# Altium schematic sheet 3_Load_Cell_Biasing.SchDoc
size A3; Organization: Altium Limited; Address1: L3, 12a Rodborough Rd; Address2: Frenchs Forest; Address3: NSW; Address4: Australia 2086; SheetNumber: 3; SheetTotal: 8
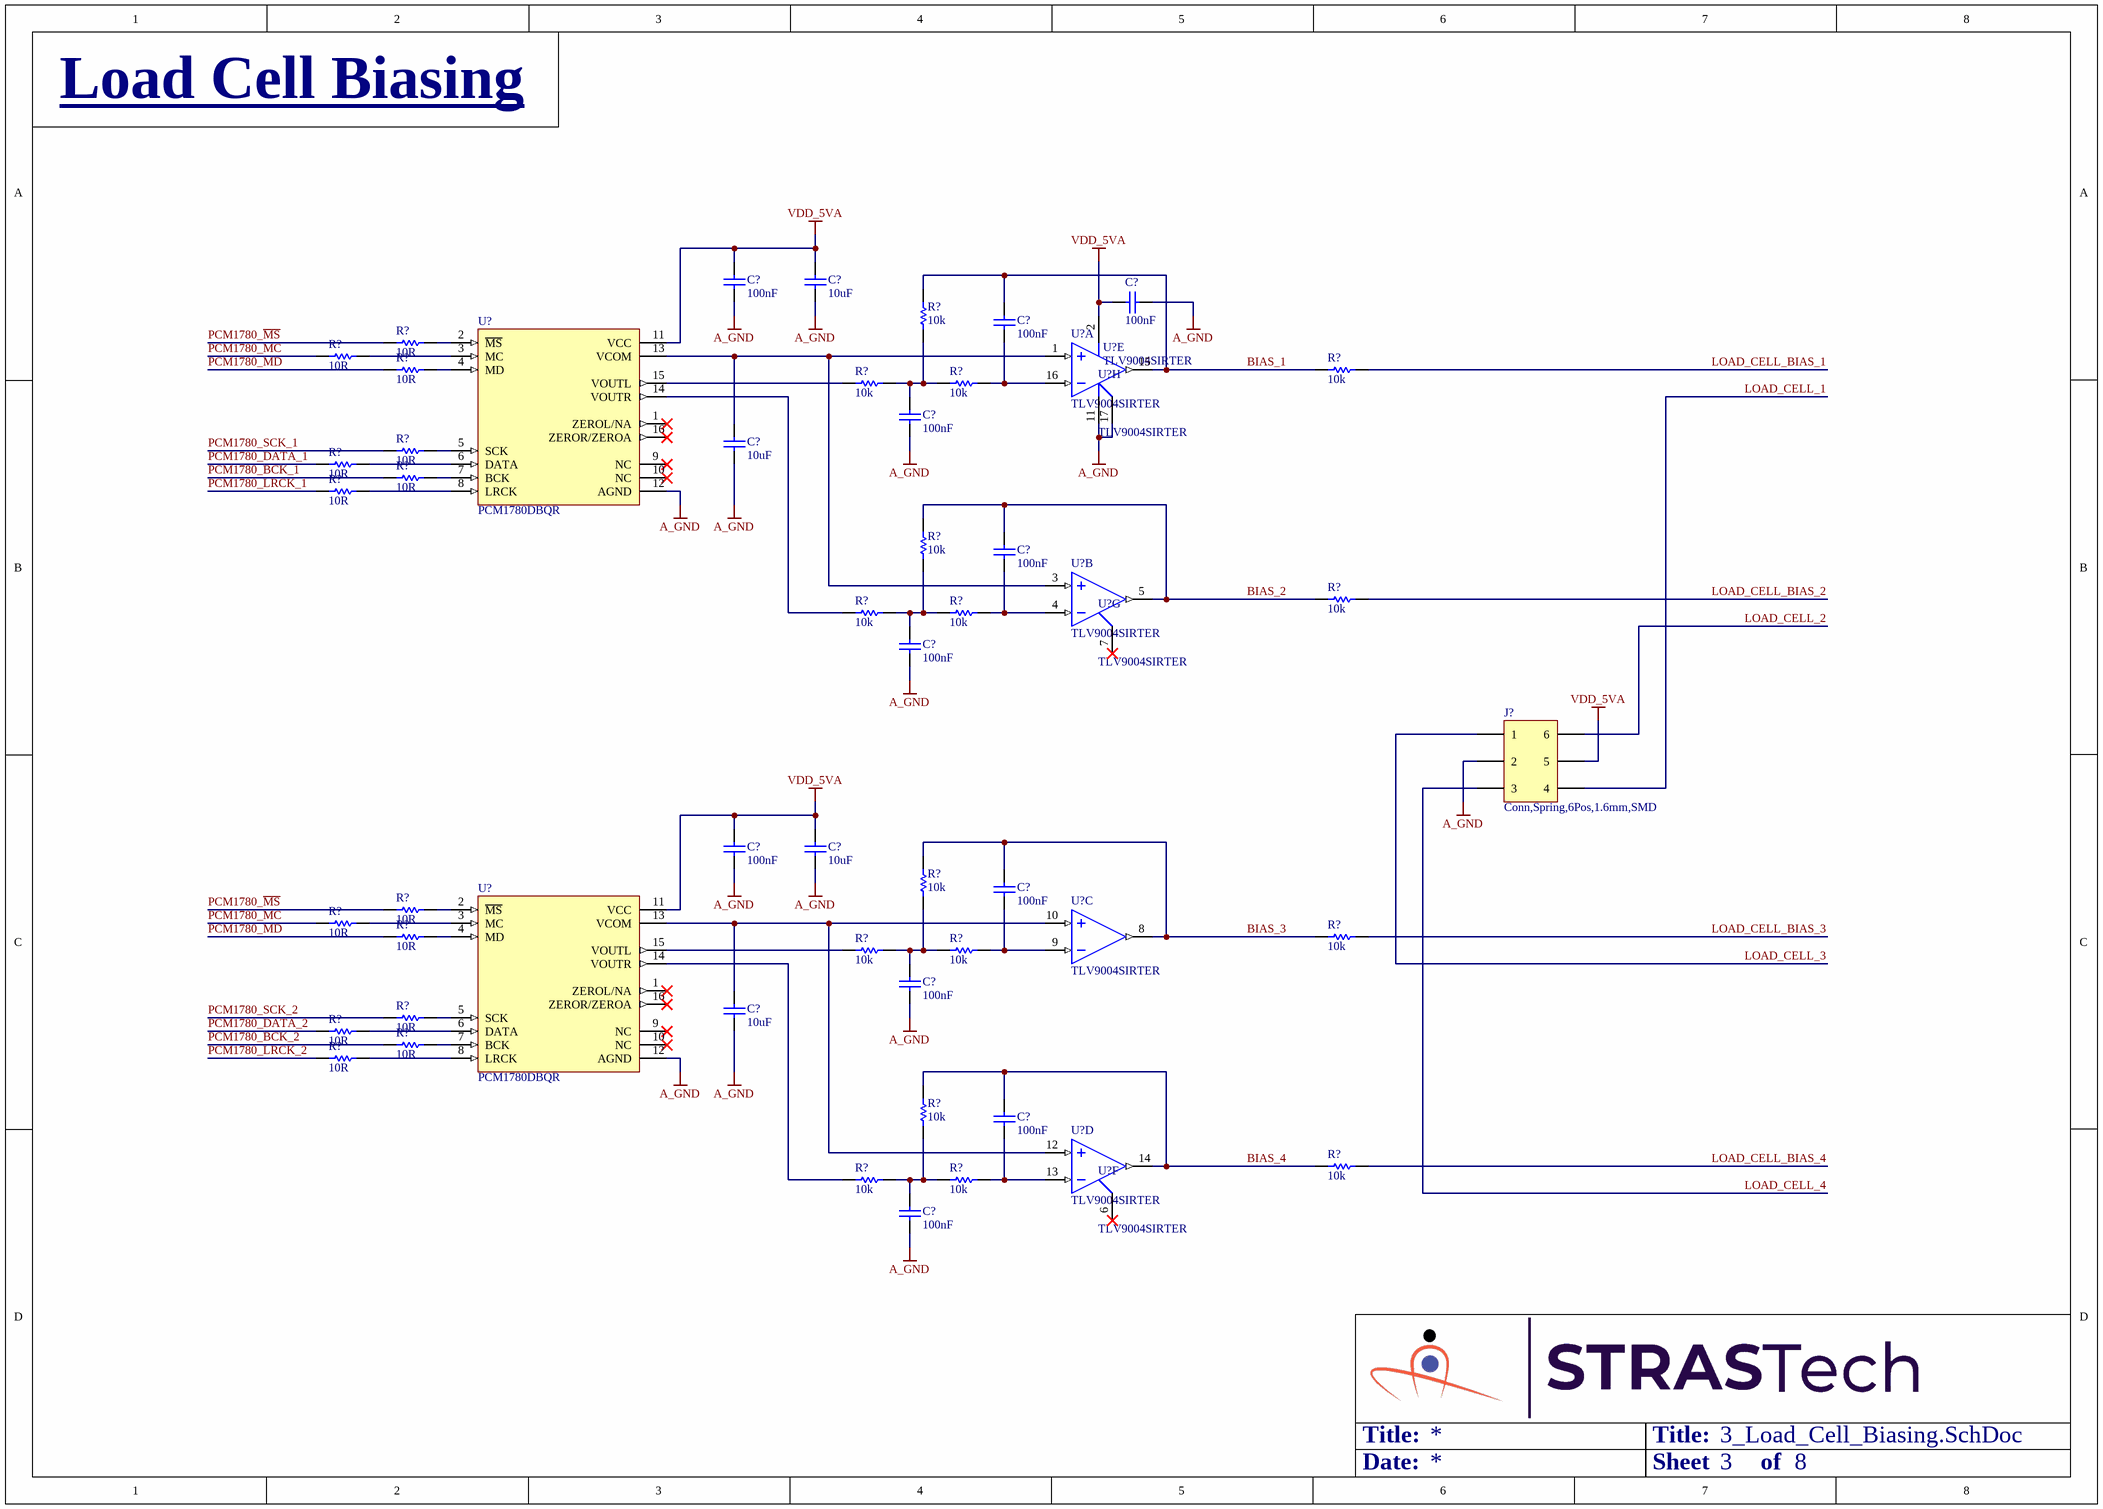
[diagram p0: 3_Load_Cell_Biasing.SchDoc]

## Parts
(Parts that share a designator on the sheet are numbered #1, #2 ... from top to bottom, then left to right.)
C?#1  100nF  [Cap,SMD,0402]
C?#2  10uF  [Cap,SMD,0402]
C?#3  100nF  [Cap,SMD,0402]
C?#4  100nF  [Cap,SMD,0402]
C?#5  100nF  [Cap,SMD,0402]
C?#6  10uF  [Cap,SMD,0402]
C?#7  100nF  [Cap,SMD,0402]
C?#8  100nF  [Cap,SMD,0402]
C?#9  100nF  [Cap,SMD,0402]
C?#10  10uF  [Cap,SMD,0402]
C?#11  100nF  [Cap,SMD,0402]
C?#12  100nF  [Cap,SMD,0402]
C?#13  10uF  [Cap,SMD,0402]
C?#14  100nF  [Cap,SMD,0402]
C?#15  100nF  [Cap,SMD,0402]
J?  Conn,Spring,6Pos,1.6mm,SMD
R?#1  10k  [RES,0402]
R?#2  10R  [RES,0402]
R?#3  10R  [RES,0402]
R?#4  10R  [RES,0402]
R?#5  10k  [RES,0402]
R?#6  10k  [RES,0402]
R?#7  10k  [RES,0402]
R?#8  10R  [RES,0402]
R?#9  10R  [RES,0402]
R?#10  10R  [RES,0402]
R?#11  10R  [RES,0402]
R?#12  10k  [RES,0402]
R?#13  10k  [RES,0402]
R?#14  10k  [RES,0402]
R?#15  10k  [RES,0402]
R?#16  10k  [RES,0402]
R?#17  10R  [RES,0402]
R?#18  10R  [RES,0402]
R?#19  10R  [RES,0402]
R?#20  10k  [RES,0402]
R?#21  10k  [RES,0402]
R?#22  10k  [RES,0402]
R?#23  10R  [RES,0402]
R?#24  10R  [RES,0402]
R?#25  10R  [RES,0402]
R?#26  10R  [RES,0402]
R?#27  10k  [RES,0402]
R?#28  10k  [RES,0402]
R?#29  10k  [RES,0402]
R?#30  10k  [RES,0402]
U?#1  PCM1780DBQR  [IC,TSSOP-16,W3.9,P0.635MM]
U?#2  TLV9004SIRTER  [IC,QFN-16,3x3]  (part A of 8)
U?#3  TLV9004SIRTER  [IC,QFN-16,3x3]  (part E of 8)
U?#4  TLV9004SIRTER  [IC,QFN-16,3x3]  (part H of 8)
U?#5  TLV9004SIRTER  [IC,QFN-16,3x3]  (part B of 8)
U?#6  TLV9004SIRTER  [IC,QFN-16,3x3]  (part G of 8)
U?#7  PCM1780DBQR  [IC,TSSOP-16,W3.9,P0.635MM]
U?#8  TLV9004SIRTER  [IC,QFN-16,3x3]  (part C of 8)
U?#9  TLV9004SIRTER  [IC,QFN-16,3x3]  (part D of 8)
U?#10  TLV9004SIRTER  [IC,QFN-16,3x3]  (part F of 8)

## Nets
A_GND: C?#1.1 C?#2.1 C?#3.1 C?#5.1 C?#6.2 C?#8.1 C?#9.1 C?#10.1 C?#12.1 C?#13.2 C?#15.1 J?.2 U?#1.12(AGND) U?#3.11(V-) U?#4.17(PAD) U?#7.12(AGND)
VDD_5VA: C?#1.2 C?#2.2 C?#3.2 C?#9.2 C?#10.2 J?.5 U?#1.11(VCC) U?#3.2(V+) U?#7.11(VCC)
BIAS_1: C?#4.2 R?#1.2 R?#5.2 U?#2.15(OUT1)
BIAS_2: C?#7.2 R?#12.2 R?#13.2 U?#5.5(OUT2)
BIAS_3: C?#11.2 R?#16.2 R?#20.2 U?#8.8(OUT3)
BIAS_4: C?#14.2 R?#27.2 R?#28.2 U?#9.14(OUT4)
LOAD_CELL_1: J?.4
LOAD_CELL_2: J?.6
LOAD_CELL_3: J?.1
LOAD_CELL_4: J?.3
LOAD_CELL_BIAS_1: R?#5.1
LOAD_CELL_BIAS_2: R?#13.1
LOAD_CELL_BIAS_3: R?#20.1
LOAD_CELL_BIAS_4: R?#28.1
PCM1780_BCK_1: R?#10.1
PCM1780_BCK_2: R?#25.1
PCM1780_DATA_1: R?#9.1
PCM1780_DATA_2: R?#24.1
PCM1780_LRCK_1: R?#11.1
PCM1780_LRCK_2: R?#26.1
PCM1780_~{MS}: R?#2.1 R?#17.1
PCM1780_MC: R?#3.1 R?#18.1
PCM1780_MD: R?#4.1 R?#19.1
PCM1780_SCK_1: R?#8.1
PCM1780_SCK_2: R?#23.1
NetC?#4_1: C?#4.1 R?#7.2 U?#2.16(IN1-)
NetC?#5_2: C?#5.2 R?#1.1 R?#6.2 R?#7.1
NetC?#6_1: C?#6.1 U?#1.13(VCOM) U?#2.1(IN1+) U?#5.3(IN2+)
NetC?#7_1: C?#7.1 R?#15.2 U?#5.4(IN2-)
NetC?#8_2: C?#8.2 R?#12.1 R?#14.2 R?#15.1
NetC?#11_1: C?#11.1 R?#22.2 U?#8.9(IN3-)
NetC?#12_2: C?#12.2 R?#16.1 R?#21.2 R?#22.1
NetC?#13_1: C?#13.1 U?#7.13(VCOM) U?#8.10(IN3+) U?#9.12(IN4+)
NetC?#14_1: C?#14.1 R?#30.2 U?#9.13(IN4-)
NetC?#15_2: C?#15.2 R?#27.1 R?#29.2 R?#30.1
NetR?#2_2: R?#2.2 U?#1.2(~{MS})
NetR?#3_2: R?#3.2 U?#1.3(MC)
NetR?#4_2: R?#4.2 U?#1.4(MD)
NetR?#6_1: R?#6.1 U?#1.15(VOUTL)
NetR?#8_2: R?#8.2 U?#1.5(SCK)
NetR?#9_2: R?#9.2 U?#1.6(DATA)
NetR?#10_2: R?#10.2 U?#1.7(BCK)
NetR?#11_2: R?#11.2 U?#1.8(LRCK)
NetR?#14_1: R?#14.1 U?#1.14(VOUTR)
NetR?#17_2: R?#17.2 U?#7.2(~{MS})
NetR?#18_2: R?#18.2 U?#7.3(MC)
NetR?#19_2: R?#19.2 U?#7.4(MD)
NetR?#21_1: R?#21.1 U?#7.15(VOUTL)
NetR?#23_2: R?#23.2 U?#7.5(SCK)
NetR?#24_2: R?#24.2 U?#7.6(DATA)
NetR?#25_2: R?#25.2 U?#7.7(BCK)
NetR?#26_2: R?#26.2 U?#7.8(LRCK)
NetR?#29_1: R?#29.1 U?#7.14(VOUTR)

Not connected (* = marked no-connect by the designer): U?#1 1(ZEROL/NA)* 9(NC)* 10(NC)* 16(ZEROR/ZEROA)*; U?#6 7(~{SHDN}34)*; U?#7 1(ZEROL/NA)* 9(NC)* 10(NC)* 16(ZEROR/ZEROA)*; U?#10 6(~{SHDN}12)*

## Notes on the sheet
- Load Cell Biasing
- Title:
- Date:
- Sheet
- of
- Title
- Size:
- A3
- Revision:
- Design By:

## Library data of the parts
C?#1 C?#3-C?#5 C?#7-C?#9 C?#11 C?#12 C?#14 C?#15 = CAP,Cer,100nF,25VDC,X7R,0402: 0.1µF ±10% 25V Ceramic Capacitor X7R 0402 (1005 Metric); Vendor Part Number: 490-14603-1-ND; Manufacturer: Murata Electronics; Manufacturer Part Number: GRM155R71E104KE14J; Vendor: Digikey; HelpURL: https://search.murata.co.jp/Ceramy/image/img/A01X/G101/ENG/GRM155R71E104KE14-01.pdf; CreatedBy: Judd Foster
C?#2 C?#6 C?#10 C?#13 = CAP,Cer,10uF,10VDC,X5R,0402: 10 µF ±20% 10V Ceramic Capacitor X5R 0402 (1005 Metric); Vendor Part Number: 1276-1450-1-ND; Manufacturer: Samsung Electro-Mechanics; Manufacturer Part Number: CL05A106MP5NUNC; Vendor: Digikey; HelpURL: https://media.digikey.com/pdf/Data%20Sheets/Samsung%20PDFs/CL05A106MP5NUNC_Spec.pdf; CreatedBy: Judd Foster
J? = Conn,Spring,6Pos,1.6mm,SMD: 6 Position Spring Compression Contact, Non-Gendered Connector Surface Mount; Vendor Part Number: A118087CT-ND; Manufacturer: TE Connectivity AMP Connectors; Manufacturer Part Number: 1932771-1; Vendor: Digikey; HelpURL: https://www.te.com/commerce/DocumentDelivery/DDEController?Action=srchrtrv&DocNm=1932771&DocType=Customer+Drawing&DocLang=English; CreatedBy: Judd Foster
R?#1 R?#5-R?#7 R?#12-R?#16 R?#20-R?#22 R?#27-R?#30 = RES,10k,5%,0.063W,0402: 10 kOhms ±5% 0.063W, 1/16W Chip Resistor 0402 (1005 Metric) Automotive AEC-Q200 Thick Film; Vendor Part Number: RMCF0402JT10K0CT-ND; Manufacturer: Stackpole Electronics Inc; Manufacturer Part Number: RMCF0402JT10K0; Vendor: DIgikey; HelpURL: https://www.seielect.com/catalog/sei-rmcf_rmcp.pdf; CreatedBy: Judd Foster
R?#2-R?#4 R?#8-R?#11 R?#17-R?#19 R?#23-R?#26 = RES,10R,1%,0.063W,0402: 10 Ohms ±1% 0.063W, 1/16W Chip Resistor 0402 (1005 Metric) Automotive AEC-Q200 Thick Film; Manufacturer: Panasonic Electronic Components; Manufacturer Part Number: ERJ-2RKF10R0X; Vendor Part Number: P10.0LCT-ND; Vendor: Digikey; CreatedBy: Judd Foster; HelpURL: https://industrial.panasonic.com/cdbs/www-data/pdf/RDA0000/AOA0000C304.pdf
U?#1 U?#7 = PCM1780DBQR: DAC, Audio 24 b 200k I²S 16-SSOP; Manufacturer: Texas Instruments; Vendor Part Number: 296-41373-1-ND; Vendor: Digikey; Manufacturer Part Number: PCM1780DBQR; HelpURL: https://www.ti.com/general/docs/suppproductinfo.tsp?distId=10&gotoUrl=https%3A%2F%2Fwww.ti.com%2Flit%2Fgpn%2Fpcm1780; CreatedBy: Judd Foster
U?#2-U?#6 U?#8-U?#10 = TLV9004SIRTER: General Purpose Amplifier 4 Circuit Rail-to-Rail 16-WQFN (3x3); Manufacturer: Texas Instruments; Vendor Part Number: 296-51829-1-ND; Vendor: Digikey; CreatedBy: Judd Foster; HelpURL: https://www.ti.com/general/docs/suppproductinfo.tsp?distId=10&gotoUrl=https%3A%2F%2Fwww.ti.com%2Flit%2Fgpn%2Ftlv9004; Manufacturer Part Number: TLV9004SIRTER